# Altium schematic sheet Encodeurs.Schematic.SchDoc
size A
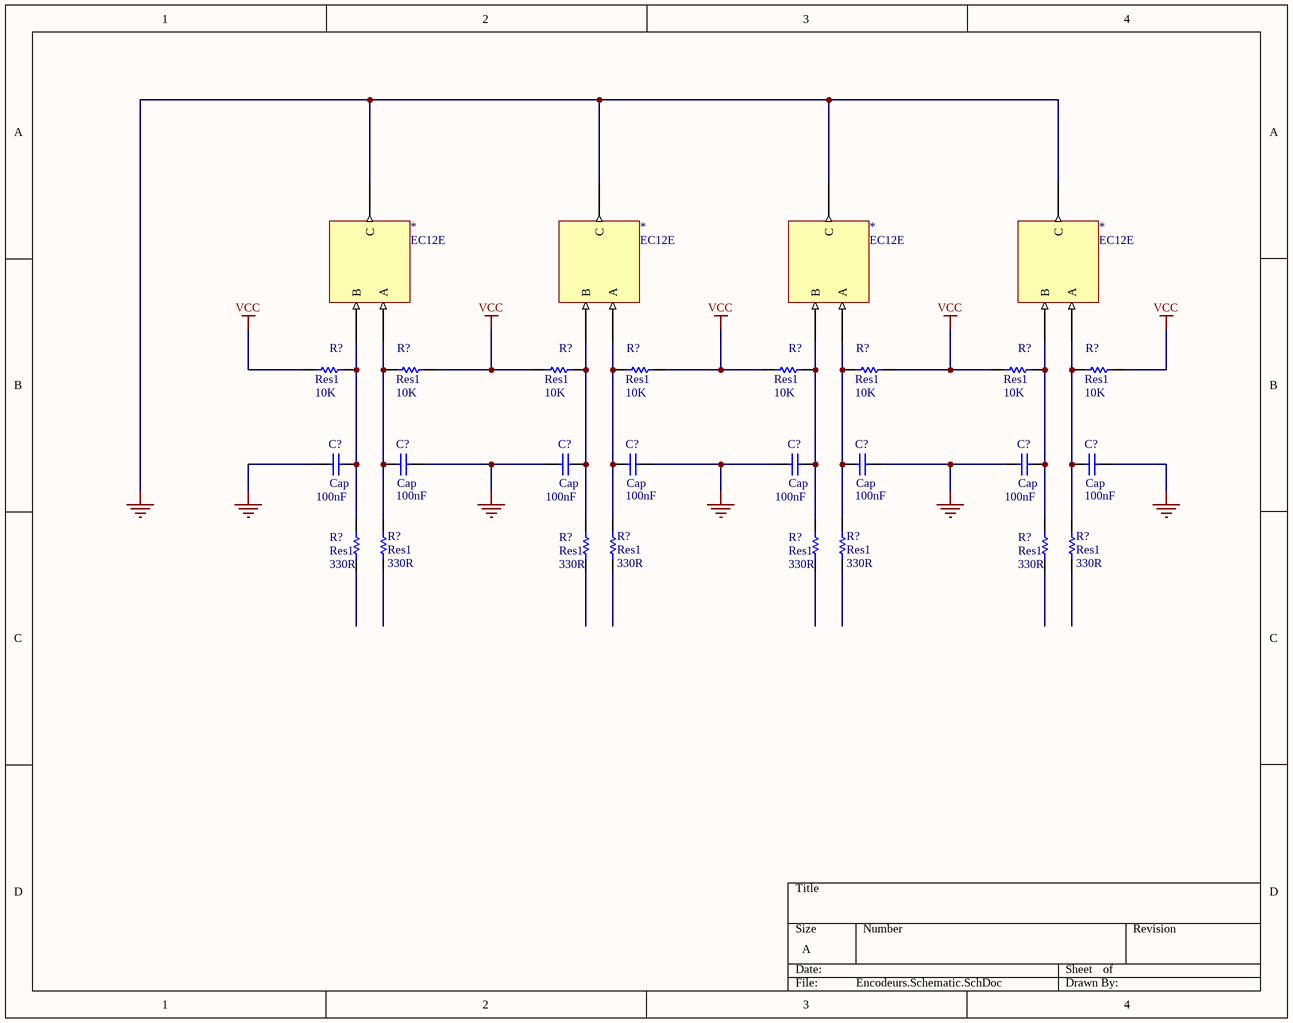
[diagram p0: Encodeurs.Schematic.SchDoc]

## Parts
(Parts that share a designator on the sheet are numbered #1, #2 ... from top to bottom, then left to right.)
*#1  EC12E
*#2  EC12E
*#3  EC12E
*#4  EC12E
C?#1  Cap  value 100nF  [RAD-0.3]
C?#2  Cap  value 100nF  [RAD-0.3]
C?#3  Cap  value 100nF  [RAD-0.3]
C?#4  Cap  value 100nF  [RAD-0.3]
C?#5  Cap  value 100nF  [RAD-0.3]
C?#6  Cap  value 100nF  [RAD-0.3]
C?#7  Cap  value 100nF  [RAD-0.3]
C?#8  Cap  value 100nF  [RAD-0.3]
R?#1  Res1  value 10K  [AXIAL-0.3]
R?#2  Res1  value 10K  [AXIAL-0.3]
R?#3  Res1  value 10K  [AXIAL-0.3]
R?#4  Res1  value 10K  [AXIAL-0.3]
R?#5  Res1  value 10K  [AXIAL-0.3]
R?#6  Res1  value 10K  [AXIAL-0.3]
R?#7  Res1  value 10K  [AXIAL-0.3]
R?#8  Res1  value 10K  [AXIAL-0.3]
R?#9  Res1  value 330R  [AXIAL-0.3]
R?#10  Res1  value 330R  [AXIAL-0.3]
R?#11  Res1  value 330R  [AXIAL-0.3]
R?#12  Res1  value 330R  [AXIAL-0.3]
R?#13  Res1  value 330R  [AXIAL-0.3]
R?#14  Res1  value 330R  [AXIAL-0.3]
R?#15  Res1  value 330R  [AXIAL-0.3]
R?#16  Res1  value 330R  [AXIAL-0.3]

## Nets
GND: *#1.GND(C) *#2.GND(C) *#3.GND(C) *#4.GND(C) C?#1.1 C?#2.1 C?#3.1 C?#4.1 C?#5.1 C?#6.1 C?#7.1 C?#8.1
VCC: R?#1.2 R?#2.2 R?#3.2 R?#4.2 R?#5.2 R?#6.2 R?#7.2 R?#8.2
Net*#1_Pin A: *#1.Pin_A(A) C?#5.2 R?#1.1 R?#9.1
Net*#1_Pin B: *#1.Pin_B(B) C?#1.2 R?#5.1 R?#13.2
Net*#2_Pin A: *#2.Pin_A(A) C?#6.2 R?#2.1 R?#10.1
Net*#2_Pin B: *#2.Pin_B(B) C?#2.2 R?#6.1 R?#14.2
Net*#3_Pin A: *#3.Pin_A(A) C?#7.2 R?#3.1 R?#11.1
Net*#3_Pin B: *#3.Pin_B(B) C?#3.2 R?#7.1 R?#15.2
Net*#4_Pin A: *#4.Pin_A(A) C?#8.2 R?#4.1 R?#12.1
Net*#4_Pin B: *#4.Pin_B(B) C?#4.2 R?#8.1 R?#16.2

Not connected (* = marked no-connect by the designer): R?#9 2; R?#10 2; R?#11 2; R?#12 2; R?#13 1; R?#14 1; R?#15 1; R?#16 1

## Library data of the parts
C?#1-C?#8 = Cap: Capacitor; Published: 8-Jun-2000; LatestRevisionDate: 17-Jul-2002; LatestRevisionNote: Re-released for DXP Platform.; PackageReference: RAD-0.3; Publisher: Altium Limited; PackageDescription: Radial Cap, Thru-Hole; 2 Leads; 0.3 in Pin Spacing
R?#1-R?#16 = Res1: Resistor; Published: 8-Jun-2000; LatestRevisionDate: 17-Jul-2002; LatestRevisionNote: Re-released for DXP Platform.; PackageReference: AXIAL-0.3; Publisher: Altium Limited; PackageDescription: Axial Device, Thru-Hole; 2 Leads; 0.3 in Pin Spacing